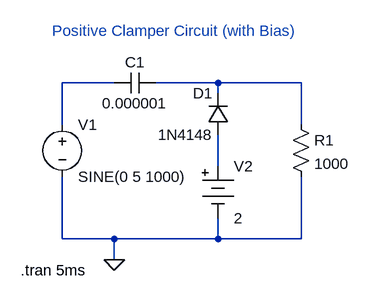
[diagram p0: schematic Assignment 2a (ii).asc]
Assignment 2a (ii).asc, the LTspice schematic file:
Version 4.1
SHEET 1 880 680
WIRE 192 64 112 64
WIRE 352 64 256 64
WIRE 480 64 352 64
WIRE 352 80 352 64
WIRE 112 128 112 64
WIRE 480 128 480 64
WIRE 352 192 352 144
WIRE 112 304 112 208
WIRE 192 304 112 304
WIRE 352 304 352 272
WIRE 352 304 192 304
WIRE 480 304 480 208
WIRE 480 304 352 304
WIRE 192 336 192 304
FLAG 192 336 0
SYMBOL voltage 112 112 R0
WINDOW 123 0 0 Left 0
WINDOW 39 0 0 Left 0
SYMATTR InstName V1
SYMATTR Value SINE(0 5 1000)
SYMBOL cap 256 48 R90
WINDOW 0 0 32 VBottom 2
WINDOW 3 32 32 VTop 2
SYMATTR InstName C1
SYMATTR Value 0.000001
SYMBOL diode 368 144 R180
WINDOW 0 24 64 Left 2
WINDOW 3 24 0 Left 2
SYMATTR InstName D1
SYMATTR Value 1N4148
SYMBOL Misc\\battery 352 176 R0
WINDOW 123 0 0 Left 0
WINDOW 39 0 0 Left 0
SYMATTR InstName V2
SYMATTR Value 2
SYMBOL res 464 112 R0
SYMATTR InstName R1
SYMATTR Value 1000
TEXT 48 352 Left 2 !.tran 5ms
TEXT 96 -16 Left 2 ;Positive Clamper Circuit (with Bias)

The netlist it stands for:
* Assignment 2a (ii).asc
V1 N001 0 SINE(0 5 1000)
C1 N002 N001 0.000001
D1 N003 N002 1N4148
V2 N003 0 2
R1 N002 0 1000
.model D D
.lib standard.dio
.tran 5ms
* Positive Clamper Circuit (with Bias)
.backanno
.end